# EAGLE design hot_plate_controller (EAGLE 9.5.1)
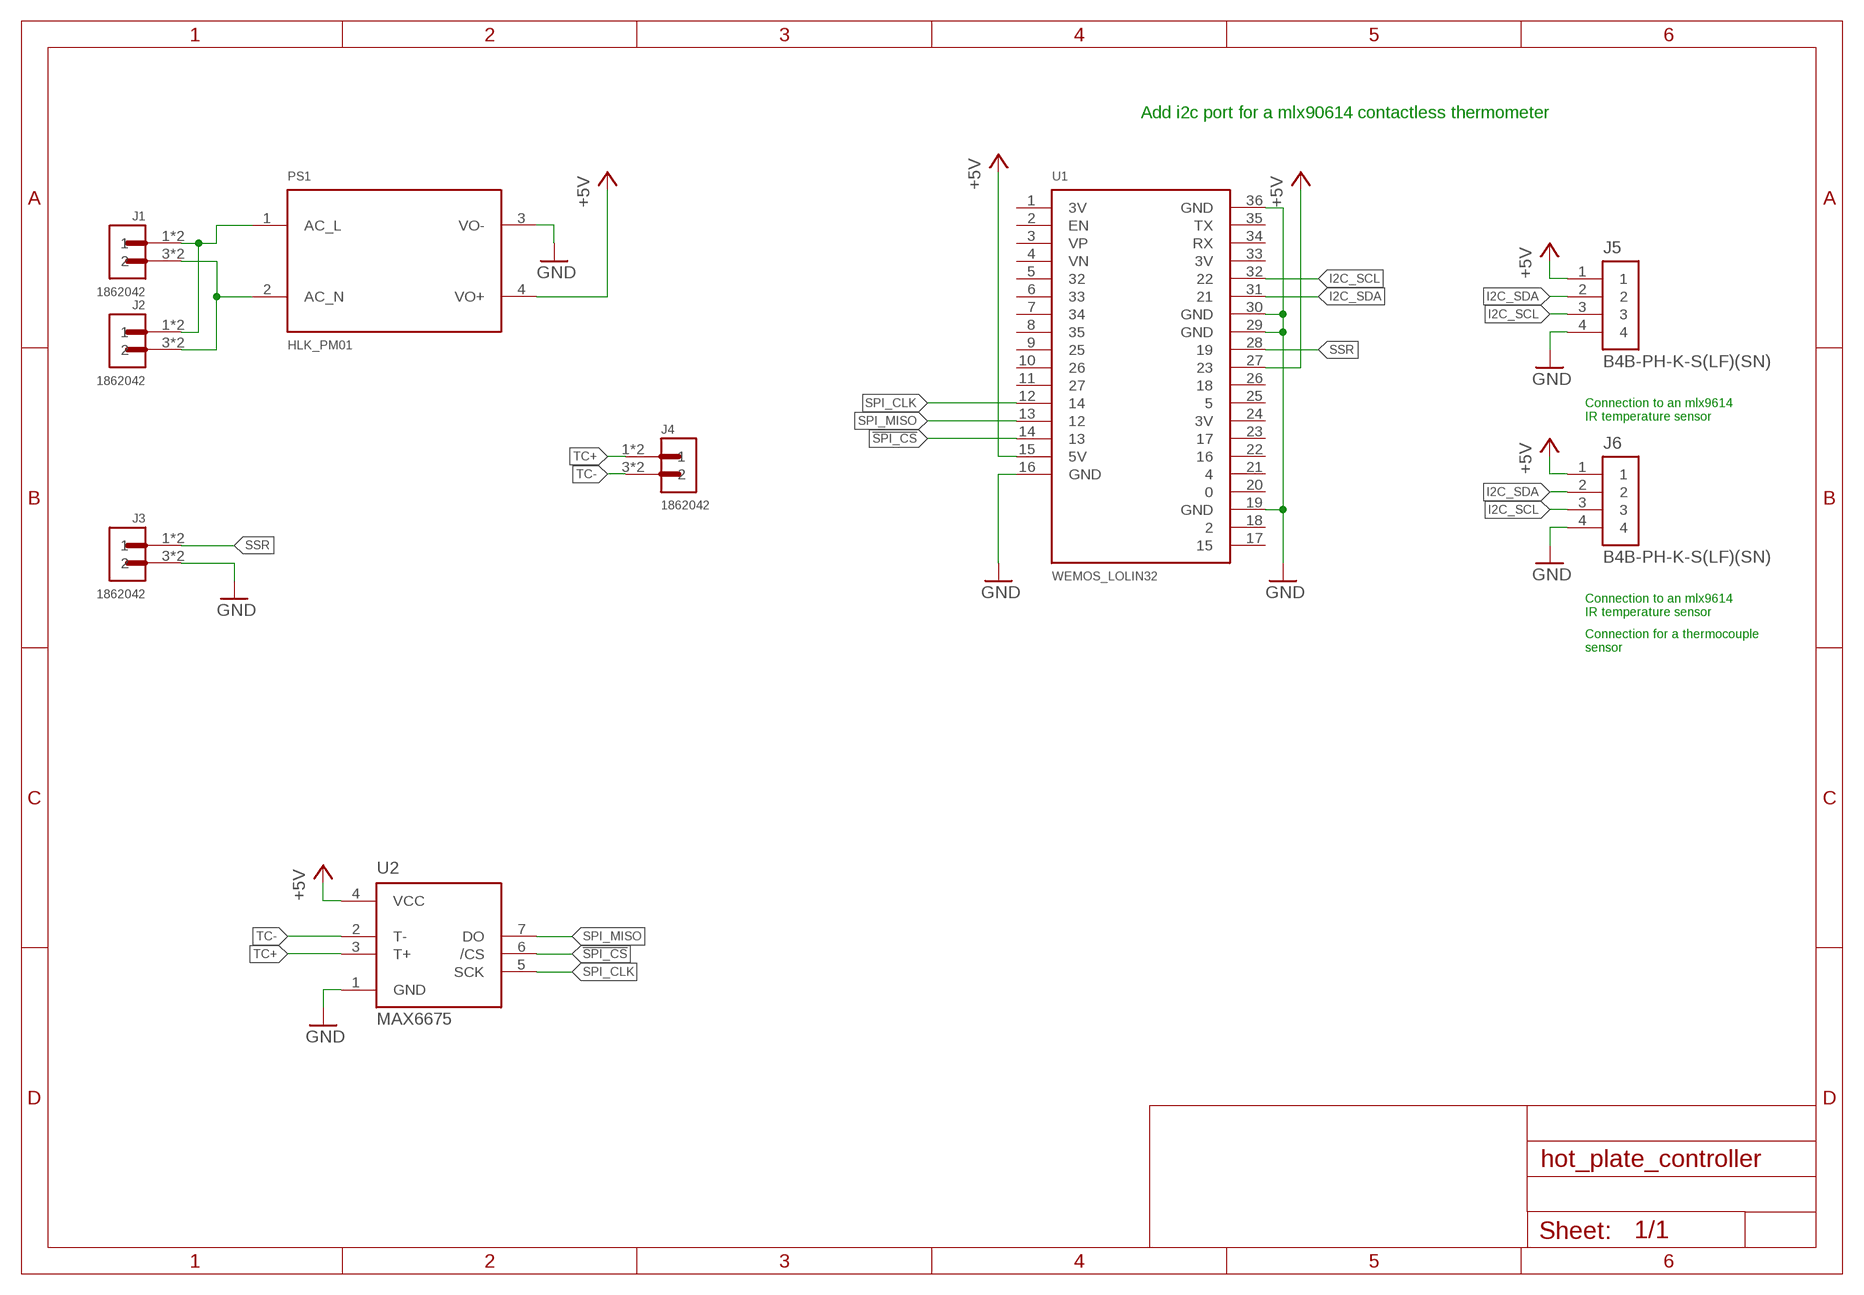
[diagram p0: schematic, sheet 1]

## Parts
J1  1862042  [PHOENIX_1862042]
J2  1862042  [PHOENIX_1862042]
J3  1862042  [PHOENIX_1862042]
J4  1862042  [PHOENIX_1862042]
J5  B4B-PH-K-S(LF)(SN)  [JST_B4B-PH-K-S(LF)(SN)]
J6  B4B-PH-K-S(LF)(SN)  [JST_B4B-PH-K-S(LF)(SN)]
PS1  HLK_PM01  [HLK_PM]
U1  WEMOS_LOLIN32  [WEMOS_LOLIN32]
U2  MAX6675  [SO08]

## Nets
!SPI_CS: U1.14 U2.6(/CS)
+5V: J5.1 J6.1 PS1.4(VO+) U1.15(5V) U1.27 U2.4(VCC)
AC_L: J1.1 J1.2 J2.1 J2.2 PS1.1(AC_L)
AC_N: J1.3 J1.4 J2.3 J2.4 PS1.2(AC_N)
GND: J3.3 J3.4 J5.4 J6.4 PS1.3(VO-) U1.16(GND) U1.19(GND) U1.29(GND) U1.30(GND) U1.36(GND) U2.1(GND)
I2C_SCL: J5.3 J6.3 U1.32
I2C_SDA: J5.2 J6.2 U1.31
SPI_CLK: U1.12 U2.5(SCK)
SPI_MISO: U1.13 U2.7(DO)
SSR: J3.1 J3.2 U1.28
TC+: J4.1 J4.2 U2.3(T+)
TC-: J4.3 J4.4 U2.2(T-)
Unconnected: U1.1(3V) U1.2(EN) U1.3(VP) U1.4(VN) U1.5 U1.6 U1.7 U1.8 U1.9 U1.10 U1.11 U1.17 U1.18 U1.20 U1.21 U1.22 U1.23 U1.24(3V) U1.25 U1.26 U1.33(3V) U1.34(RX) U1.35(TX)

## Notes on the sheet
- Add i2c port for a mlx90614 contactless thermometer
- Connection to an mlx9614 
  IR temperature sensor
- Connection to an mlx9614 
  IR temperature sensor
- Connection for a thermocouple 
  sensor

## Library data of the parts
J1-J4 = RE_hot_plate_controller:1862042: PCB TERMINAL BLOCK 2POS 3.5MM; DISTRIBUTOR: Mouser; DISTRIBUTOR_REF: 651-1862042; MANUFACTURER: Phoenix Contact; MANUFACTURER_REF: 1862042
J5 J6 = RE_hot_plate_controller:B4B-PH-K-S(LF)(SN): PH Series 4 Position 2 mm Pitch Through Hole Crimp Top Entry Shrouded Header; DISTRIBUTOR: Farnell; DISTRIBUTOR_REF: 9492437; MANUFACTURER: JST; MANUFACTURER_REF: B4B-PH-K-S(LF)(SN)
PS1 = RE_hot_plate_controller:HLK_PM01: HLK PM01: AC DC Converter with 5V outpt Input Voltage Range = 100~240V Output Voltage = 5V Output Power 3W Efficiency <70% Please refer to The manufacturer website <http://www.hlktech.net/product_detail.php?ProId=54> for more information.
U1 = RE_hot_plate_controller:WEMOS_LOLIN32: WEMOS LOLIN32 V1.0.0 WiFi + Bluetooth Board Based ESP 32 4MB Flash With Lithium battery interface, 500mA Max charging current Please refer to This Link <https://wiki.wemos.cc/products:lolin32:lolin32> for more information ABOUT THE MODULE. Please refer to This Link <https://www.amazon.de/Ils-LOLIN32-V1-0-0-Bluetooth-ESP-32/dp/B07687C66W/ref=sr_1_1?keywords=wemos+lolin32&qid=1553872538&s=gateway&sr=8-1> for the ORDERED MODEL.
U2 = RE_hot_plate_controller:MAX6675; DISTRIBUTOR: None; DISTRIBUTOR_REF: None; MANUFACTURER: Maxim Integrated; MANUFACTURER_REF: MAX6675

## Board
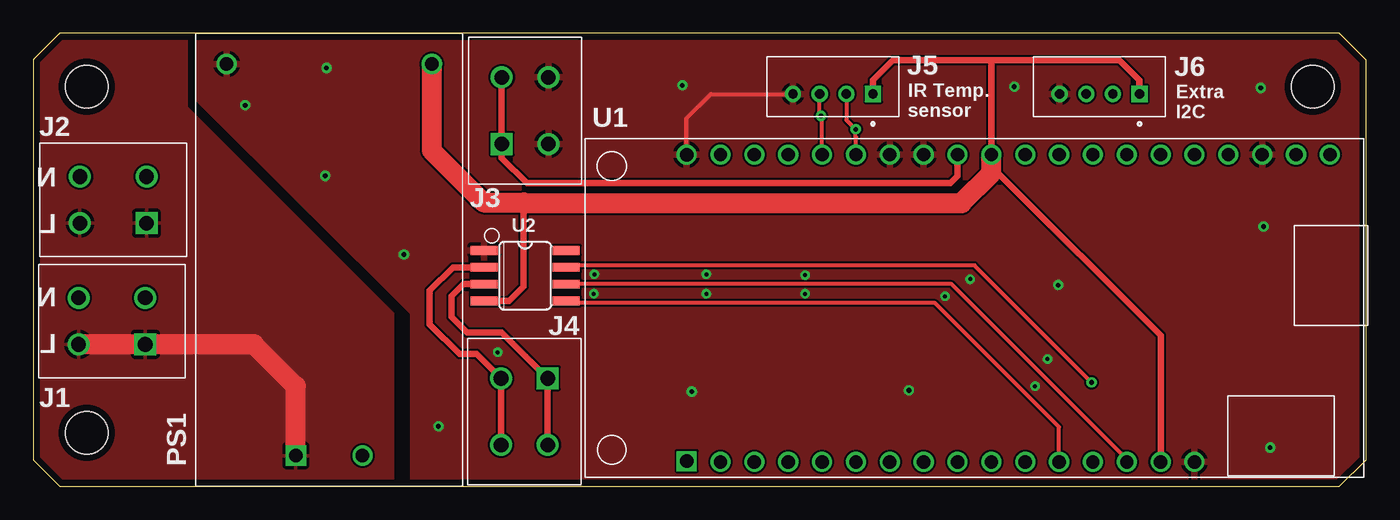
[diagram p1: board, top side]
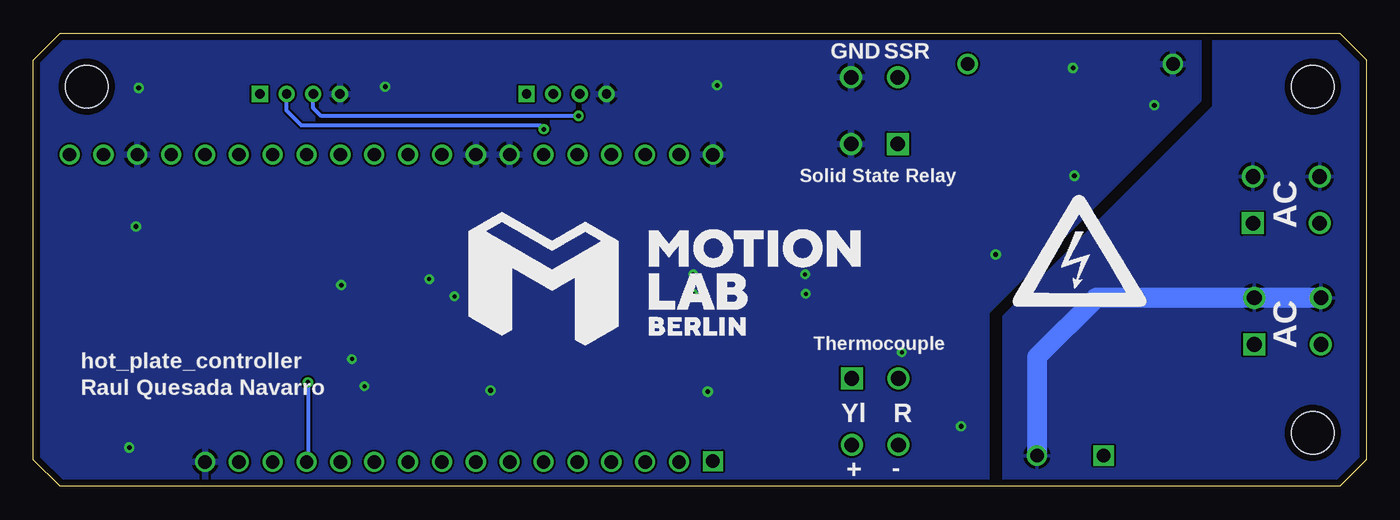
[diagram p2: board, bottom side, seen from below]

Size 100 x 34 mm. Coordinates in mm from the lower left corner, seen from the top.
Outline: 0.01,32.01 0,2 2,0 98,0 100,2 100,32 98,34 2,34 0.01,32.01
Copper layers (1*16): Top 0.035mm / dielectric 1.5mm / Bottom 0.035mm
Design rules "custom_PCBWay_2layers *": minimum track width 6mil, minimum drill 0.3mm, track to track 6mil, track to pad 6mil, pad to pad 6mil, via to via 6mil, smd to smd 6mil, copper to edge 20mil, drill to drill 6mil, minimum pad ring 10mil, minimum via ring 8mil, stop-mask expansion 4mil, vias tented up to drill 1mm, thermal gap 10mil
Holes 3.2 mm at 4,4 4,30 96,30

### Footprints (pad centres in the part's own frame; a part is rotated, then mirrored left to right if it is on the bottom)
PHOENIX_1862042 = drill 1.1 square: 1 -1.75,-2.5 | drill 1.1: 2 -1.75,2.5; 3 1.75,-2.5; 4 1.75,2.5
JST_B4B-PH-K-S(LF)(SN) = drill 0.7 square: 1 3,-0.55 | drill 0.7: 2 1,-0.55; 3 -1,-0.55; 4 -3,-0.55
HLK_PM = drill 1 square: 1 -14.7,2.5 | drill 1: 2 -14.7,-2.5; 3 14.7,7.7; 4 14.7,-7.7
WEMOS_LOLIN32 = drill 1 square: 1 -11.5,21.59 | drill 1: 2 -11.56,19.05; 3 -11.56,16.51; 4 -11.56,13.97; 5 -11.56,11.43; 6 -11.56,8.89; 7 -11.56,6.35; 8 -11.56,3.81; 9 -11.56,1.27; 10 -11.56,-1.27; 11 -11.56,-3.81; 12 -11.56,-6.35; 13 -11.56,-8.89; 14 -11.56,-11.43; 15 -11.56,-13.97; 16 -11.56,-16.51; 17 11.51,-26.67; 18 11.51,-24.13; 19 11.51,-21.59; 20 11.51,-19.05; 21 11.51,-16.51; 22 11.51,-13.97; 23 11.51,-11.43; 24 11.51,-8.89; 25 11.51,-6.35; 26 11.51,-3.81; 27 11.51,-1.27; 28 11.51,1.27; 29 11.51,3.81; 30 11.51,6.35; 31 11.51,8.89; 32 11.51,11.43; 33 11.51,13.97; 34 11.51,16.51; 35 11.51,19.05; 36 11.5,21.59
SO08 = smd 2.032 x 0.66: 1 -3.073,1.905; 2 -3.073,0.635; 3 -3.073,-0.635; 4 -3.073,-1.905; 5 3.073,-1.905; 6 3.073,-0.635; 7 3.073,0.635; 8 3.073,1.905

### Placement (x,y rotation side)
J1  5.9,12.4 90 top
J2  6,21.5 90 top
J3  36.9,28.2 0 top
J4  36.85,5.6 180 top
J5  60,30 0 top
J6  80,30 0 top
PS1  22.2,17 90 top
U1  70.61,13.38 90 top
U2  36.9,15.8 0 top
U$1  [ML_LOGO_TEXT_10MM]  55,15 0 bottom
U$2  [HIGH_VOLTAGE_LOGO_10MM]  26.5,13.5 0 bottom

### Tracks (layer width: path | path; a pad name or v marks a point on that pad's centre or on a via)
!SPI_CS
  Top 0.3: U1.14 82.04,2.02 68.89,15.16 U2.6
+5V
  Top 0.5: U2.4 35.69,13.89 36.8,15 36.8,21.25 36.8,21.3 | 71.88,23.48 72.42,23.48 84.58,11.32 U1.15 | J6.1 83,30.5 81.5,32 71.9,32 | 71.9,32 64.5,32 63,30.5 J5.1 | U1.27 71.88,31.98 71.9,32
  Top 1.5: PS1.4 29.9,25.2 33.8,21.3 36.8,21.3 | 36.8,21.25 69.65,21.25 71.88,23.48 U1.27
AC_L
  Top 1.5: PS1.1 19.7,7.5 16.55,10.65 J1.1 J1.2
  pour Top: -1,36 11.5,36 11.5,28.5 27,13 27,-2 -1,-2
AC_N
  Bottom 1.5: PS1.2 24.7,9.7 20.25,14.15 J1.4 J1.3
  pour Bottom: 27.25,-2 -1.5,-2 -1.5,36 11.5,36 11.5,28.5 27.25,12.75
GND  (via drill 0.3, 0.35)
  Top 0.3: U1.36 49.02,27.62 50.85,29.45 J5.4
  other vias: 42.1,15.9 42.05,14.45 50.5,15.9 50.5,14.45 57.9,15.85 57.9,14.45 68.4,14.25 70.3,15.55 76.1,9.55 75.15,7.5 34.85,10.05 48.7,30.1 73.6,30 92.1,29.9 49.4,7.1 65.7,7.2 76.9,15.1 92.3,19.5 92.8,2.9 15.9,28.6 21.9,23.3 27.8,17.4 30.4,4.5 22,31.4
  pour Top: 28.5,-1 28.5,13 12.5,28.96 12.5,35 101,35 101,-1
  pour Bottom: 12.58,36 102,36 102,-2 28.5,-2 28.5,13.07 12.58,29
I2C_SCL  (via drill 0.35)
  Top 0.3: U1.32 59.18,27.72 v59.1,27.8 59,27.9 J5.3
  Bottom 0.3: v59.1,27.8 78.4,27.8 79,28.4 J6.3
I2C_SDA  (via drill 0.35)
  Top 0.3: U1.31 61.72,26.18 61.7,26.2 v61.7,26.8 61,27.5 J5.2
  Bottom 0.3: v61.7,26.8 62,27.1 79.9,27.1 81,28.2 J6.2
SPI_CLK
  Top 0.3: U1.12 76.96,4.44 67.65,13.74 40.07,13.74 39.97,13.85 U2.5
SPI_MISO  (via drill 0.35)
  Top 0.3: v79.4,7.8 70.61,16.59 40.07,16.59 39.97,16.48 U2.7
  Bottom 0.3: v79.4,7.8 79.4,1.92 U1.13
SSR
  Top 0.5: U1.28 69.34,23.29 68.8,22.75 37.05,22.75 35.15,24.65 J3.1 J3.2
TC+
  Top 0.5: U2.3 32.26,15.16 31.4,14.3 31.4,12.7 32.55,11.55 35.15,11.55 J4.1 J4.2
TC-
  Top 0.5: U2.2 31.48,16.43 29.75,14.7 29.75,12.15 31.97,9.93 33.27,9.93 J4.3 J4.4

### Text on the board
tPlace: IR Temp. / sensor | Extra / I2C | N | L | N | L
bPlace: SSR | GND | AC | Solid State Relay | AC | Thermocouple | Raul Quesada Navarro | R | Yl | - | +